# EAGLE design SBC6809R3 (EAGLE 4.16)
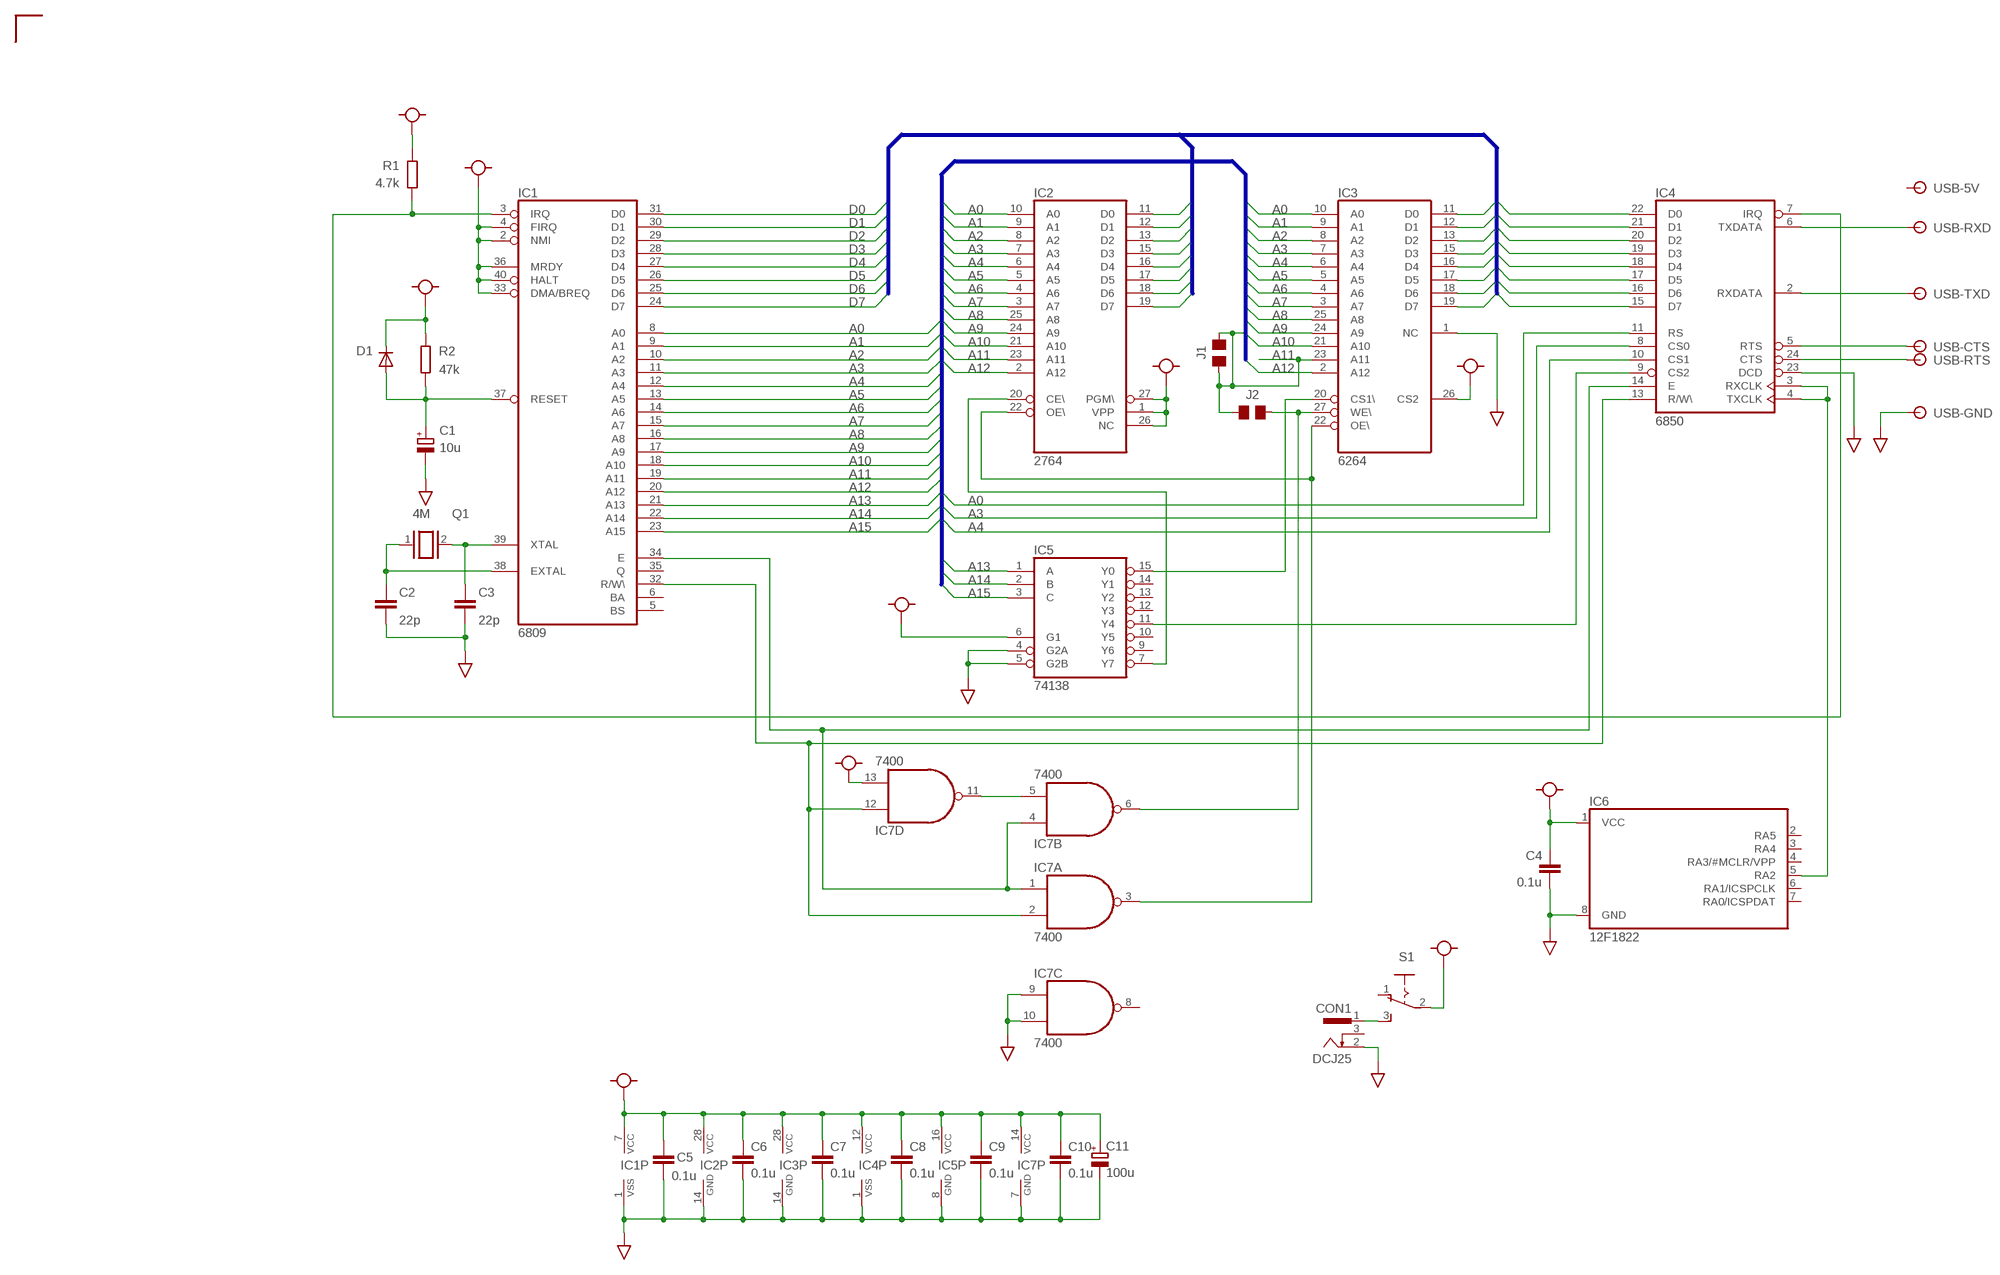
[diagram p0: schematic, sheet 1]

## Parts
C1  10u  C-TANTALUM  [C4518]
C2  22p  C-CERAMIC  [C025-025X050]
C3  22p  C-CERAMIC  [C025-025X050]
C4  0.1u  C-CERAMIC  [C025-025X050]
C5  0.1u  C-CERAMIC  [C025-025X050]
C6  0.1u  C-CERAMIC  [C025-025X050]
C7  0.1u  C-CERAMIC  [C025-025X050]
C8  0.1u  C-CERAMIC  [C025-025X050]
C9  0.1u  C-CERAMIC  [C025-025X050]
C10  0.1u  C-CERAMIC  [C025-025X050]
C11  100u  C-TANTALUM  [C4518]
CON1  DCJ25  [SCD-014-A]
D1  1S1588  [DO41-10]
IC1  6809  [DIL40]
IC2  2764  [DIL28]
IC3  6264  6264ASP  [DIL28-3]
IC4  6850  [DIL24]
IC5  74138  [DIL16]
IC6  12F1822  PIC12F1822  [DIL08]
IC7  7400  [DIL14]
J1  SOLPAD  [SOLPAD]
J2  SOLPAD  [SOLPAD]
Q1  4M  XTAL/S  [QS]
R1  4.7k  R1/8W  [0207/10]
R2  47k  R1/8W  [0207/10]
S1  255SB  [255SB]
USB-  USB-SERIAL6P  [TTL-232R-5V]

## Nets
A0: IC1.8(A0) IC2.10(A0) IC3.10(A0) IC4.11(RS)
A1: IC1.9(A1) IC2.9(A1) IC3.9(A1)
A2: IC1.10(A2) IC2.8(A2) IC3.8(A2)
A3: IC1.11(A3) IC2.7(A3) IC3.7(A3) IC4.8(CS0)
A4: IC1.12(A4) IC2.6(A4) IC3.6(A4) IC4.10(CS1)
A5: IC1.13(A5) IC2.5(A5) IC3.5(A5)
A6: IC1.14(A6) IC2.4(A6) IC3.4(A6)
A7: IC1.15(A7) IC2.3(A7) IC3.3(A7)
A8: IC1.16(A8) IC2.25(A8) IC3.25(A8)
A9: IC1.17(A9) IC2.24(A9) IC3.24(A9)
A10: IC1.18(A10) IC2.21(A10) IC3.21(A10)
A11: IC1.19(A11) IC2.23(A11) IC3.23(A11) J1.1 J1.2 J2.1
A12: IC1.20(A12) IC2.2(A12) IC3.2(A12)
A13: IC1.21(A13) IC5.1(A)
A14: IC1.22(A14) IC5.2(B)
A15: IC1.23(A15) IC5.3(C)
D0: IC1.31(D0) IC2.11(D0) IC3.11(D0) IC4.22(D0)
D1: IC1.30(D1) IC2.12(D1) IC3.12(D1) IC4.21(D1)
D2: IC1.29(D2) IC2.13(D2) IC3.13(D2) IC4.20(D2)
D3: IC1.28(D3) IC2.15(D3) IC3.15(D3) IC4.19(D3)
D4: IC1.27(D4) IC2.16(D4) IC3.16(D4) IC4.18(D4)
D5: IC1.26(D5) IC2.17(D5) IC3.17(D5) IC4.17(D5)
D6: IC1.25(D6) IC2.18(D6) IC3.18(D6) IC4.16(D6)
D7: IC1.24(D7) IC2.19(D7) IC3.19(D7) IC4.15(D7)
GND: C1.- C2.2 C3.2 C4.2 C5.2 C6.2 C7.2 C8.2 C9.2 C10.2 C11.- CON1.2 IC1.1(GND) IC2.14(GND) IC3.1(NC) IC3.14(GND) IC4.1(GND) IC4.23(DCD) IC5.4(G2A) IC5.5(G2B) IC5.8(GND) IC6.8(GND) IC7.7(P:GND) IC7.9(C:I0) IC7.10(C:I1) USB-.1
N$1: IC3.20(CS1\) IC5.15(Y0)
N$2: IC2.20(CE\) IC5.7(Y7)
N$3: IC1.3(IRQ) IC4.7(IRQ) R1.1
N$5: IC2.22(OE\) IC3.22(OE\) IC7.3(A:O)
N$6: IC7.5(B:I1) IC7.11(D:O)
N$7: IC1.32(R/W\) IC4.13(R/W\) IC7.2(A:I1) IC7.12(D:I0)
N$8: C2.1 IC1.38(EXTAL) Q1.1
N$9: CON1.1 S1.3(S)
N$10: IC4.3(RXCLK) IC4.4(TXCLK) IC6.5(RA2)
N$11: IC4.6(TXDATA) USB-.5
N$12: IC4.2(RXDATA) USB-.4
N$13: IC4.5(RTS) USB-.2
N$14: IC4.24(CTS) USB-.6
N$15: IC4.9(CS2) IC5.11(Y4)
N$16: IC3.27(WE\) IC7.6(B:O) J2.2
N$17: C3.1 IC1.39(XTAL) Q1.2
N$18: C1.+ D1.A IC1.37(RESET) R2.1
N$25: IC1.34(E) IC4.14(E) IC7.1(A:I0) IC7.4(B:I0)
VCC: C4.1 C5.1 C6.1 C7.1 C8.1 C9.1 C10.1 C11.+ D1.C IC1.2(NMI) IC1.4(FIRQ) IC1.7(VCC) IC1.33(DMA/BREQ) IC1.36(MRDY) IC1.40(HALT) IC2.1(VPP) IC2.26(NC) IC2.27(PGM\) IC2.28(VCC) IC3.26(CS2) IC3.28(VCC) IC4.12(VCC) IC5.6(G1) IC5.16(VCC) IC6.1(VCC) IC7.13(D:I1) IC7.14(P:VCC) R1.2 R2.2 S1.2(P)
Unconnected: CON1.3 IC1.5(BS) IC1.6(BA) IC1.35(Q) IC5.9(Y6) IC5.10(Y5) IC5.12(Y3) IC5.13(Y2) IC5.14(Y1) IC6.2(RA5) IC6.3(RA4) IC6.4(RA3/#MCLR/VPP) IC6.6(RA1/ICSPCLK) IC6.7(RA0/ICSPDAT) IC7.8(C:O) S1.1(O) USB-.3

## Buses
A[0..15]
D[0..7]

## Library data of the parts
C1 C11 = olimex-devices:C-TANTALUM: Tantalum Condenser
C2-C10 = olimex-devices:C-CERAMIC: Ceramic Conenser
CON1 = olimex-devices:DCJ25: Standerd AC Adupter Jack
D1 = olimex-devices:1S1588: Small Signal Diode
IC1 = olimex-devices:6809: MOTOROLA CPU
IC2 = olimex-devices:2764: MEMORY UVEPROM 8Kbit x 8
IC3 = olimex-devices:6264ASP
IC4 = olimex-devices:6850: MOTOROLA ACIA
IC5 = olimex-devices:74138: 3-line to 8-line DECODER/DEMULTIPLEXER
IC6 = olimex-devices:PIC12F1822
IC7 = olimex-devices:7400: Quad 2-input NAND gate
J1 J2 = olimex-devices:SOLPAD
Q1 = olimex-devices:XTAL/S: X'tal Oscirator
R1 R2 = olimex-devices:R1/8W: Carbon Resistor
S1 = olimex-devices:255SB: SLIDING SWITCH distributor Buerklin, 11G810
USB- = olimex-devices:USB-SERIAL6P

## Net classes
2 Vcc: width 0.508 mm

## Board
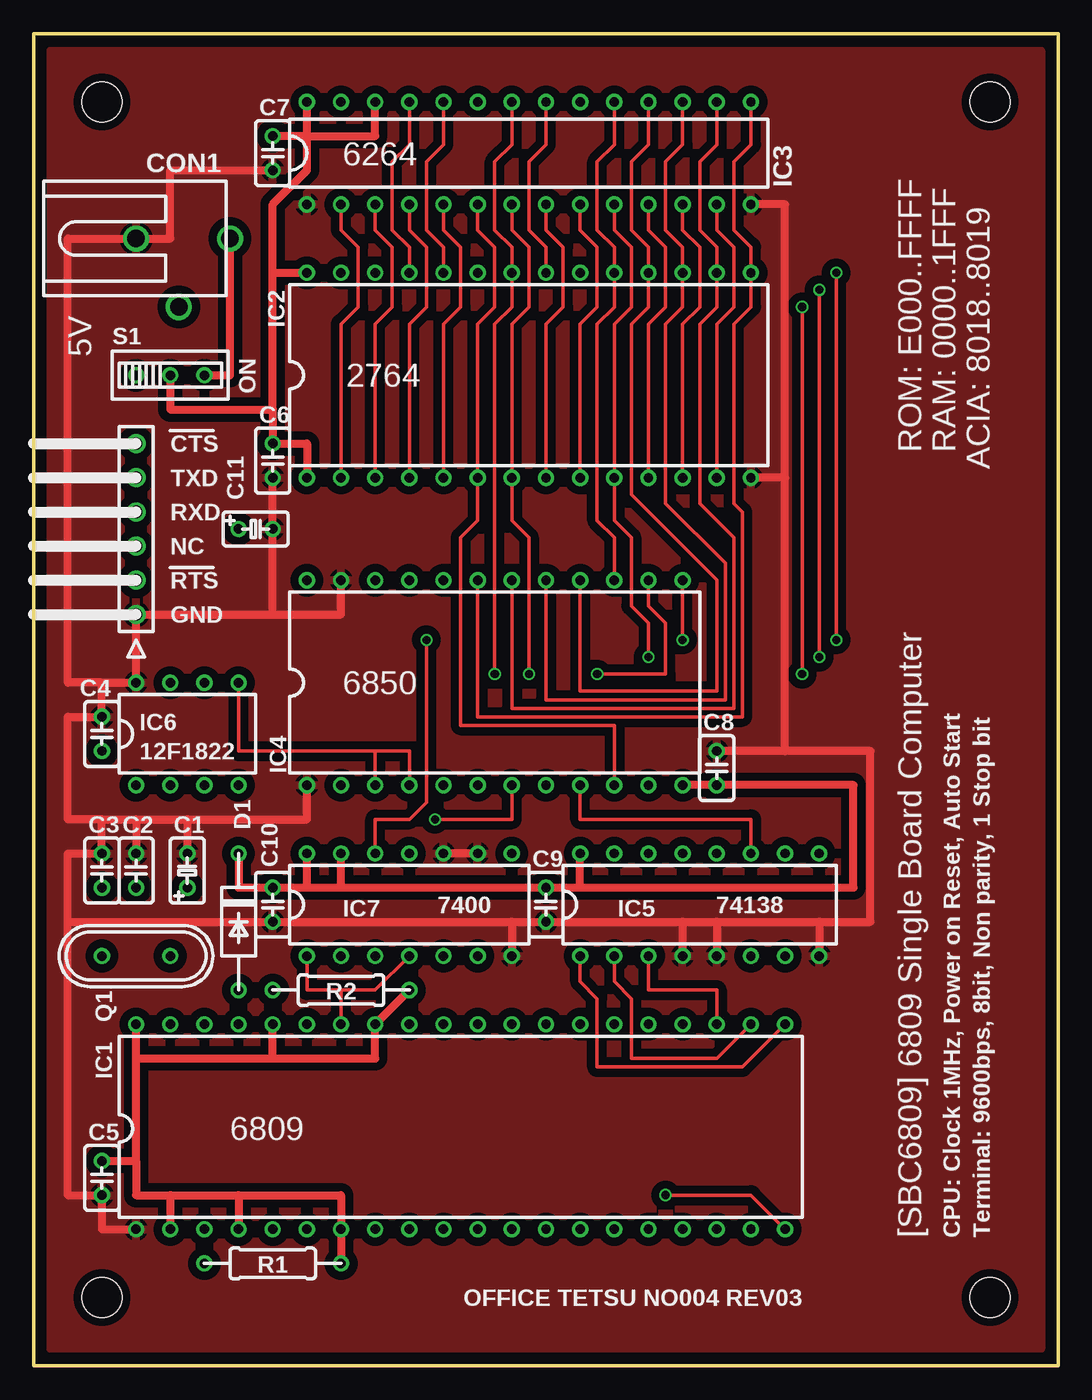
[diagram p1: board, top side]
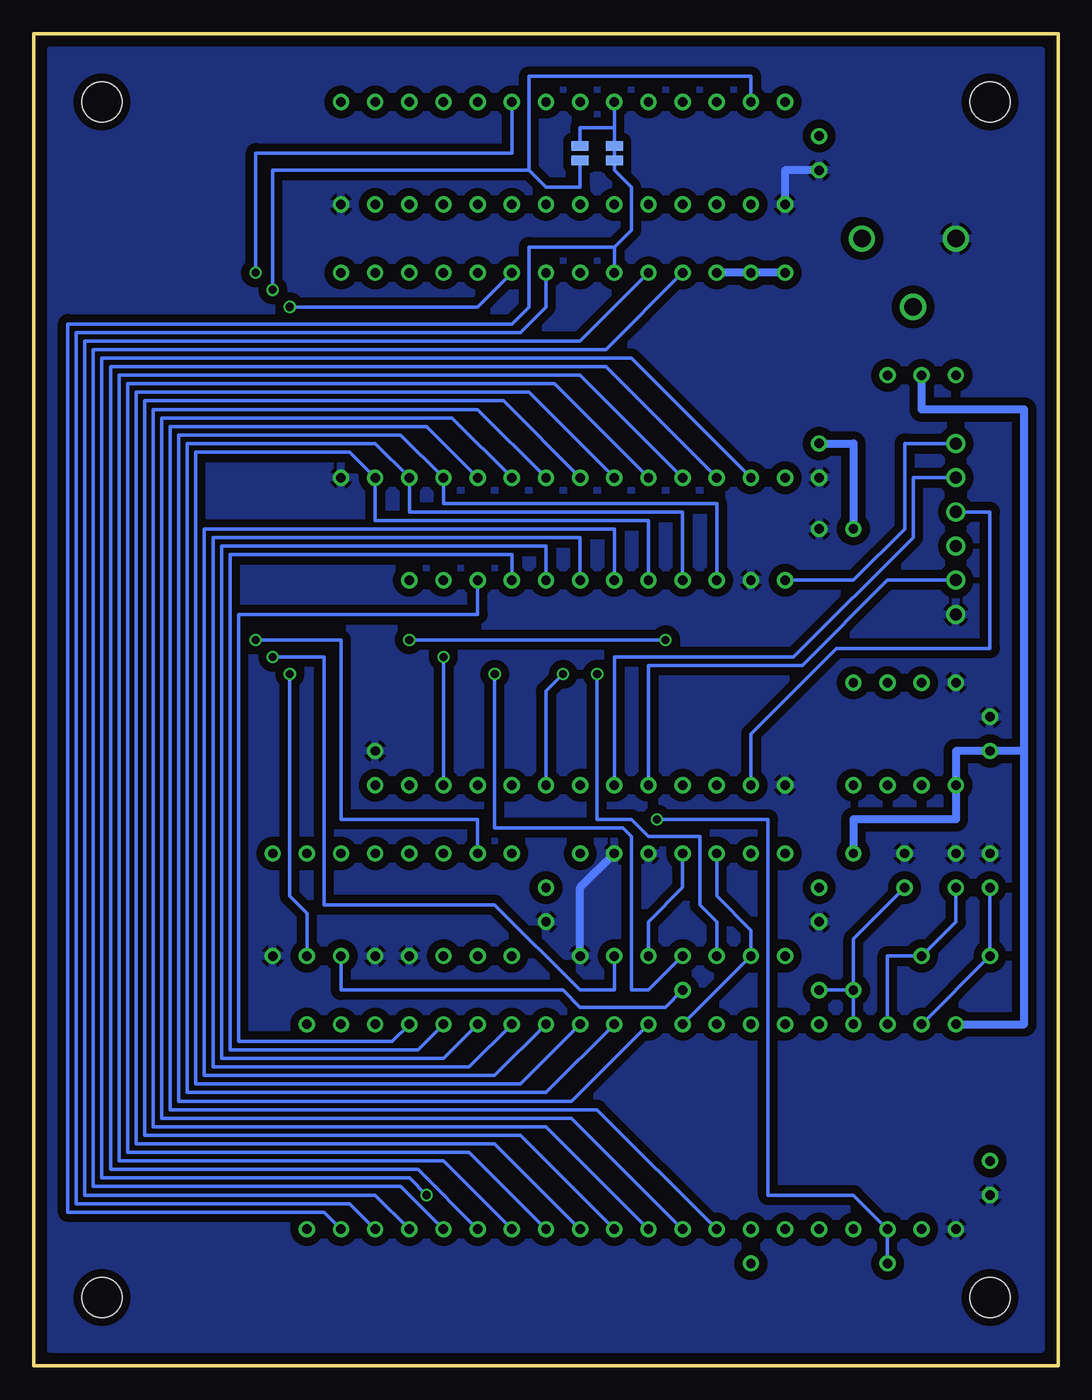
[diagram p2: board, bottom side, seen from below]

Size 76.2 x 99.06 mm. Coordinates in mm from the lower left corner, seen from the top.
Outline: 76.2,0 76.2,99.06 0,99.06 0,0 76.2,0
Copper layers (1*16): Top 0.035mm / dielectric 1.5mm / Bottom 0.035mm
Design rules "SeeedStudio": minimum track width 6mil, minimum drill 12mil, track to track 6mil, track to pad 6mil, pad to pad 6mil, via to via 6mil, smd to smd 0mil, copper to edge 10mil, drill to drill 10mil, minimum pad ring 10mil, minimum via ring 6mil, stop-mask expansion 2mil, vias tented up to drill 25mil, thermal gap 10mil
Holes 3 mm at 5.08,5.08 71.12,5.08 71.12,93.98 5.08,93.98

### Footprints (pad centres in the part's own frame; a part is rotated, then mirrored left to right if it is on the bottom)
C4518 = drill 0.7 round: + -1.27,0; - 1.27,0
C025-025X050 = drill 0.7 round: 1 -1.27,0; 2 1.27,0
SCD-014-A = drill 1.3 round: 1 0,11.43; 2 0,4.445; 3 5.08,7.62
DO41-10 = drill 0.7 round: A 5.08,0; C -5.08,0
DIL40 = drill 0.7 round: 1 -24.13,-7.62; 2 -21.59,-7.62; 3 -19.05,-7.62; 4 -16.51,-7.62; 5 -13.97,-7.62; 6 -11.43,-7.62; 7 -8.89,-7.62; 8 -6.35,-7.62; 9 -3.81,-7.62; 10 -1.27,-7.62; 11 1.27,-7.62; 12 3.81,-7.62; 13 6.35,-7.62; 14 8.89,-7.62; 15 11.43,-7.62; 16 13.97,-7.62; 17 16.51,-7.62; 18 19.05,-7.62; 19 21.59,-7.62; 20 24.13,-7.62; 21 24.13,7.62; 22 21.59,7.62; 23 19.05,7.62; 24 16.51,7.62; 25 13.97,7.62; 26 11.43,7.62; 27 8.89,7.62; 28 6.35,7.62; 29 3.81,7.62; 30 1.27,7.62; 31 -1.27,7.62; 32 -3.81,7.62; 33 -6.35,7.62; 34 -8.89,7.62; 35 -11.43,7.62; 36 -13.97,7.62; 37 -16.51,7.62; 38 -19.05,7.62; 39 -21.59,7.62; 40 -24.13,7.62
DIL28 = drill 0.7 round: 1 -16.51,-7.62; 2 -13.97,-7.62; 3 -11.43,-7.62; 4 -8.89,-7.62; 5 -6.35,-7.62; 6 -3.81,-7.62; 7 -1.27,-7.62; 8 1.27,-7.62; 9 3.81,-7.62; 10 6.35,-7.62; 11 8.89,-7.62; 12 11.43,-7.62; 13 13.97,-7.62; 14 16.51,-7.62; 15 16.51,7.62; 16 13.97,7.62; 17 11.43,7.62; 18 8.89,7.62; 19 6.35,7.62; 20 3.81,7.62; 21 1.27,7.62; 22 -1.27,7.62; 23 -3.81,7.62; 24 -6.35,7.62; 25 -8.89,7.62; 26 -11.43,7.62; 27 -13.97,7.62; 28 -16.51,7.62
DIL28-3 = drill 0.7 round: 1 -16.51,-3.81; 2 -13.97,-3.81; 3 -11.43,-3.81; 4 -8.89,-3.81; 5 -6.35,-3.81; 6 -3.81,-3.81; 7 -1.27,-3.81; 8 1.27,-3.81; 9 3.81,-3.81; 10 6.35,-3.81; 11 8.89,-3.81; 12 11.43,-3.81; 13 13.97,-3.81; 14 16.51,-3.81; 15 16.51,3.81; 16 13.97,3.81; 17 11.43,3.81; 18 8.89,3.81; 19 6.35,3.81; 20 3.81,3.81; 21 1.27,3.81; 22 -1.27,3.81; 23 -3.81,3.81; 24 -6.35,3.81; 25 -8.89,3.81; 26 -11.43,3.81; 27 -13.97,3.81; 28 -16.51,3.81
DIL24 = drill 0.7 round: 1 -13.97,-7.62; 2 -11.43,-7.62; 3 -8.89,-7.62; 4 -6.35,-7.62; 5 -3.81,-7.62; 6 -1.27,-7.62; 7 1.27,-7.62; 8 3.81,-7.62; 9 6.35,-7.62; 10 8.89,-7.62; 11 11.43,-7.62; 12 13.97,-7.62; 13 13.97,7.62; 14 11.43,7.62; 15 8.89,7.62; 16 6.35,7.62; 17 3.81,7.62; 18 1.27,7.62; 19 -1.27,7.62; 20 -3.81,7.62; 21 -6.35,7.62; 22 -8.89,7.62; 23 -11.43,7.62; 24 -13.97,7.62
DIL16 = drill 0.7 round: 1 -8.89,-3.81; 2 -6.35,-3.81; 3 -3.81,-3.81; 4 -1.27,-3.81; 5 1.27,-3.81; 6 3.81,-3.81; 7 6.35,-3.81; 8 8.89,-3.81; 9 8.89,3.81; 10 6.35,3.81; 11 3.81,3.81; 12 1.27,3.81; 13 -1.27,3.81; 14 -3.81,3.81; 15 -6.35,3.81; 16 -8.89,3.81
DIL08 = drill 0.7 round: 1 -3.81,-3.81; 2 -1.27,-3.81; 3 1.27,-3.81; 4 3.81,-3.81; 5 3.81,3.81; 6 1.27,3.81; 7 -1.27,3.81; 8 -3.81,3.81
DIL14 = drill 0.7 round: 1 -7.62,-3.81; 2 -5.08,-3.81; 3 -2.54,-3.81; 4 0,-3.81; 5 2.54,-3.81; 6 5.08,-3.81; 7 7.62,-3.81; 8 7.62,3.81; 9 5.08,3.81; 10 2.54,3.81; 11 0,3.81; 12 -2.54,3.81; 13 -5.08,3.81; 14 -7.62,3.81
SOLPAD = smd 0.736 x 1.27: 1 -0.54,0; 2 0.54,0
QS = drill 0.7 round: 1 -2.54,0; 2 2.54,0
0207/10 = drill 0.7 round: 1 -5.08,0; 2 5.08,0
255SB = drill 0.7 round: 1 -2.54,0; 2 0,0; 3 2.54,0
TTL-232R-5V = drill 0.9 round: 1 -6.35,0; 2 -3.81,0; 3 -1.27,0; 4 1.27,0; 5 3.81,0; 6 6.35,0

### Placement (x,y rotation side)
C1  11.43,36.83 90 top
C2  7.62,36.83 90 top
C3  5.08,36.83 90 top
C4  5.08,46.99 90 top
C5  5.08,13.97 270 top
C6  17.78,67.31 270 top
C7  17.78,90.17 270 top
C8  50.8,44.45 90 top
C9  38.1,34.29 270 top
C10  17.78,34.29 270 top
C11  16.51,62.23 0 top
CON1  3.17,83.82 270 top
D1  15.24,33.02 270 top
IC1  31.75,17.78 0 top
IC2  36.83,73.66 0 top
IC3  36.83,90.17 0 top
IC4  34.29,50.8 0 top
IC5  49.53,34.29 0 top
IC6  11.43,46.99 0 top
IC7  27.94,34.29 0 top
J1  33.02,90.17 270 bottom
J2  35.56,90.17 270 bottom
Q1  7.62,30.48 180 top
R1  17.78,7.62 0 top
R2  22.86,27.94 0 top
S1  10.16,73.66 0 top
USB-  7.62,62.23 90 top

### Tracks (layer width: path | path; a pad name or v marks a point on that pad's centre or on a via)
A0  (via drill 0.6)
  Top 0.254: IC3.10 43.18,84.45 44.45,83.19 44.45,78.74 43.18,77.47 IC2.10 43.18,62.87 44.45,61.59 44.45,56.52 45.72,55.24 v45.72,52.7
  Bottom 0.254: v45.72,52.7 IC4.11 | IC1.8 34.29,19.05 66.04,19.05 66.04,69.85 46.99,69.85 IC2.10
A1
  Top 0.254: IC2.9 40.64,77.47 41.91,78.74 41.91,83.19 40.64,84.45 IC3.9
  Bottom 0.254: IC2.9 45.09,70.48 66.67,70.48 66.67,18.41 36.2,18.41 IC1.9
A2
  Top 0.254: IC2.8 38.1,77.47 39.37,78.74 39.37,83.19 38.1,84.45 IC3.8
  Bottom 0.254: IC2.8 43.18,71.12 67.31,71.12 67.31,17.78 38.1,17.78 IC1.10
A3  (via drill 0.6)
  Top 0.254: IC3.7 35.56,84.45 36.83,83.19 36.83,78.74 35.56,77.47 IC2.7 35.56,62.87 36.83,61.59 v36.83,51.44
  Bottom 0.254: IC2.7 41.27,71.75 67.94,71.75 67.94,17.14 40.01,17.14 IC1.11 | IC4.8 38.1,50.16 v36.83,51.44
A4
  Top 0.254: IC3.6 33.02,84.45 34.29,83.19 34.29,78.74 33.02,77.47 IC2.6 33.02,62.87 31.75,61.59 31.75,47.62 43.18,47.62 IC4.10
  Bottom 0.254: IC2.6 39.37,72.39 68.58,72.39 68.58,16.51 41.91,16.51 IC1.12
A5
  Top 0.254: IC2.5 30.48,77.47 31.75,78.74 31.75,83.19 30.48,84.45 IC3.5
  Bottom 0.254: IC2.5 37.47,73.03 69.22,73.03 69.22,15.88 43.81,15.88 IC1.13
A6
  Top 0.254: IC3.4 27.94,84.45 29.21,83.19 29.21,78.74 27.94,77.47 IC2.4
  Bottom 0.254: IC2.4 35.56,73.66 69.85,73.66 69.85,15.24 45.72,15.24 IC1.14
A7
  Top 0.254: IC3.3 25.4,84.45 26.67,83.19 26.67,78.74 25.4,77.47 IC2.3
  Bottom 0.254: IC2.3 33.66,74.3 70.48,74.3 70.48,14.61 47.62,14.61 IC1.15
A8
  Top 0.254: IC3.25 27.94,90.81 26.67,89.53 26.67,84.45 27.94,83.19 IC2.25
  Bottom 0.254: IC2.25 33.66,75.56 71.75,75.56 71.75,13.34 48.9,13.34 IC1.16
A9
  Top 0.254: IC3.24 30.48,90.81 29.21,89.53 29.21,84.45 30.48,83.19 IC2.24
  Bottom 0.254: IC2.24 35.56,76.2 72.39,76.2 72.39,12.7 50.8,12.7 IC1.17
A10
  Top 0.254: IC3.21 38.1,90.81 36.83,89.53 36.83,84.45 38.1,83.19 IC2.21
  Bottom 0.254: IC2.21 38.1,78.74 40.01,76.83 73.03,76.83 73.03,12.06 52.7,12.06 IC1.18
A11
  Bottom 0.254: 33.02,83.19 31.75,84.45 31.75,87.63 33.02,88.9 J1.2 33.02,90.81 | 33.02,83.19 IC2.23 | 33.02,83.19 39.37,83.19 39.37,78.74 40.64,77.47 73.66,77.47 73.66,11.43 54.61,11.43 IC1.19 | 33.02,92.08 IC3.23 | J2.1 35.56,92.08 33.02,92.08 | 33.02,90.81 33.02,92.08 | 33.02,90.81 J1.1
A12  (via drill 0.6)
  Top 0.254: IC2.2 22.86,77.47 24.13,78.74 24.13,83.19 22.86,84.45 IC3.2 | IC1.20 53.34,12.7 v46.99,12.7
  Bottom 0.254: v46.99,12.7 48.26,13.97 71.12,13.97 71.12,74.93 31.75,74.93 IC2.2
A13
  Top 0.254: IC5.1 40.64,28.57 41.91,27.3 41.91,22.23 52.7,22.23 IC1.21
A14
  Top 0.254: IC5.2 43.18,28.57 44.45,27.3 44.45,22.86 50.8,22.86 IC1.22
A15
  Top 0.254: IC5.3 45.72,27.94 50.8,27.94 IC1.23
D0
  Top 0.254: IC2.11 45.72,77.47 46.99,78.74 46.99,83.19 45.72,84.45 IC3.11
  Bottom 0.254: IC4.22 25.4,64.14 45.72,64.14 IC2.11 48.9,69.22 65.41,69.22 65.41,19.68 36.2,19.68 IC1.31
D1
  Top 0.254: IC2.12 48.26,77.47 49.53,78.74 49.53,83.19 48.26,84.45 IC3.12
  Bottom 0.254: IC4.21 27.94,63.5 48.26,63.5 IC2.12 50.8,68.58 64.77,68.58 64.77,20.32 38.1,20.32 IC1.30
D2
  Top 0.254: IC2.13 50.8,77.47 52.07,78.74 52.07,83.19 50.8,84.45 IC3.13
  Bottom 0.254: IC4.20 30.48,62.87 50.8,62.87 IC2.13 52.7,67.94 64.14,67.94 64.14,20.95 40.01,20.95 IC1.29
D3
  Top 0.254: IC3.15 53.34,90.81 52.07,89.53 52.07,84.45 53.34,83.19 IC2.15 53.34,78.74 52.07,77.47 52.07,64.14 52.7,63.5 52.7,48.26 33.02,48.26 IC4.19
  Bottom 0.254: IC4.19 33.02,62.23 63.5,62.23 63.5,21.59 41.91,21.59 IC1.28
D4
  Top 0.254: IC3.16 50.8,90.81 49.53,89.53 49.53,84.45 50.8,83.19 IC2.16 50.8,78.74 49.53,77.47 49.53,64.14 52.07,61.59 52.07,48.9 35.56,48.9 IC4.18
  Bottom 0.254: IC4.18 35.56,61.59 62.87,61.59 62.87,22.23 43.81,22.23 IC1.27
D5
  Top 0.254: IC3.17 48.26,90.81 46.99,89.53 46.99,84.45 48.26,83.19 IC2.17 48.26,78.74 46.99,77.47 46.99,64.14 51.44,59.69 51.44,49.53 38.1,49.53 IC4.17
  Bottom 0.254: IC4.17 38.1,60.96 62.23,60.96 62.23,22.86 45.72,22.86 IC1.26
D6
  Top 0.254: IC3.18 45.72,90.81 44.45,89.53 44.45,84.45 45.72,83.19 IC2.18 45.72,78.74 44.45,77.47 44.45,64.77 50.8,58.42 50.8,50.16 40.64,50.16 IC4.16
  Bottom 0.254: IC4.16 40.64,60.33 61.59,60.33 61.59,23.5 47.62,23.5 IC1.25
D7
  Top 0.254: IC3.19 43.18,90.81 41.91,89.53 41.91,84.45 43.18,83.19 IC2.19 43.18,78.74 41.91,77.47 41.91,62.87 43.18,61.59 IC4.15
  Bottom 0.254: IC4.15 43.18,55.88 60.96,55.88 60.96,24.13 49.53,24.13 IC1.24
GND
  Top 0.61: 50.8,33.02 58.42,33.02 | 48.26,33.02 50.8,33.02 | 48.26,33.02 IC5.4 | 50.8,33.02 IC5.5 | 55.88,66.04 55.88,86.36 IC3.14 | 55.88,45.72 55.88,66.04 | 5.08,50.8 C4.2 2.54,48.26 2.54,40.64 5.08,40.64 | 5.08,50.8 IC6.8 USB-.1 17.78,55.88 | 55.88,45.72 62.23,45.72 62.23,33.02 58.42,33.02 | 5.08,40.64 7.62,40.64 | 7.62,40.64 11.43,40.64 | 11.43,40.64 20.32,40.64 IC4.1 | 5.08,50.8 2.54,50.8 2.54,83.82 CON1.2 10.16,83.82 10.16,88.9 C7.2 | 35.56,33.02 C9.2 48.26,33.02 | 35.56,33.02 C10.2 2.54,33.02 | 35.56,33.02 IC7.7 | C6.2 C11.- 17.78,55.88 | IC4.23 22.86,55.88 17.78,55.88 | 55.88,66.04 IC2.14 | IC7.9 IC7.10 | 55.88,45.72 C8.2 | 58.42,33.02 IC5.8 | 11.43,40.64 C1.- | 7.62,40.64 C2.2 | 5.08,40.64 C3.2 2.54,38.1 2.54,33.02 | IC1.1 5.08,10.16 C5.2 2.54,12.7 2.54,33.02
  Bottom 0.61: IC7.9 35.56,35.56 IC7.7 | C7.2 20.32,88.9 IC3.1
  pour Bottom (isolate 0.61): 1.27,97.79 74.93,97.79 74.93,1.27 1.27,1.27
  pour Top (isolate 0.61): 1.27,97.79 74.93,97.79 74.93,1.27 1.27,1.27
N$1  (via drill 0.6)
  Top 0.254: v59.69,53.98 v59.69,81.28
  Bottom 0.254: IC5.15 43.18,40.64 53.34,40.64 53.34,53.98 v59.69,53.98 | v59.69,81.28 59.69,90.17 40.64,90.17 IC3.20
N$2  (via drill 0.6)
  Top 0.254: v57.15,51.44 v57.15,78.74
  Bottom 0.254: IC5.7 55.88,33.66 57.15,34.92 v57.15,51.44 | v57.15,78.74 43.18,78.74 IC2.20
N$3  (via drill 0.6)
  Top 0.254: v29.84,40.64 35.56,40.64 IC4.7
  Bottom 0.254: v29.84,40.64 21.59,40.64 21.59,12.7 15.24,12.7 IC1.3 R1.1
N$5  (via drill 0.6)
  Top 0.254: IC3.22 35.56,90.81 34.29,89.53 34.29,84.45 35.56,83.19 IC2.22 35.56,78.74 34.29,77.47 v34.29,51.44
  Bottom 0.254: v34.29,51.44 34.29,40.64 31.75,40.64 30.48,39.37 26.67,39.37 26.67,34.29 25.4,33.02 IC7.3
N$6
  Bottom 0.254: IC7.5 30.48,33.02 27.94,35.56 IC7.11
N$7  (via drill 0.6)
  Top 0.254: IC7.12 25.4,40.64 27.94,40.64 29.21,41.91 v29.21,53.98 | v48.26,53.98 IC4.13
  Bottom 0.254: IC7.12 25.4,34.92 22.86,32.38 IC7.2 IC1.32 | v29.21,53.98 v48.26,53.98
N$8
  Bottom 0.254: C2.1 7.62,33.02 Q1.1 12.7,30.48 IC1.38
N$9
  Top 0.61: CON1.1 14.61,73.66 S1.3
N$10
  Top 0.254: 25.4,45.72 IC4.3 | IC6.5 15.24,45.72 25.4,45.72 | IC4.4 27.94,45.72 25.4,45.72
N$11
  Bottom 0.254: IC4.6 33.02,52.7 19.68,52.7 10.79,61.59 10.79,66.04 USB-.5
N$12
  Bottom 0.254: USB-.4 5.08,63.5 5.08,53.34 16.51,53.34 22.86,46.99 IC4.2
N$13
  Bottom 0.254: IC4.5 30.48,52.07 19.05,52.07 12.7,58.42 USB-.2
N$14
  Bottom 0.254: USB-.6 11.43,68.58 11.43,62.23 15.24,58.42 IC4.24
N$15
  Top 0.254: IC5.11 53.34,40.64 40.64,40.64 IC4.9
N$16  (via drill 0.6)
  Top 0.254: v58.42,52.7 v58.42,80.01
  Bottom 0.254: IC7.6 33.02,27.94 35.56,27.94 41.91,34.29 54.61,34.29 54.61,52.7 v58.42,52.7 | v58.42,80.01 58.42,88.9 39.37,88.9 | 39.37,88.9 39.37,95.89 22.86,95.89 IC3.27 | 39.37,88.9 38.1,87.63 35.56,87.63 J2.2
N$17
  Bottom 0.254: C3.1 Q1.2 IC1.39
N$18
  Bottom 0.254: IC1.37 D1.A | D1.A R2.1 | C1.+ 15.24,31.75 D1.A
N$25  (via drill 0.6)
  Top 0.254: 22.86,27.94 20.32,27.94 IC7.1 | 22.86,27.94 25.4,27.94 IC7.4 | v41.91,51.44 46.99,51.44 46.99,55.24 45.72,56.52 IC4.14 | IC1.34 22.86,27.94
  Bottom 0.254: IC7.4 30.48,27.94 31.75,27.94 31.75,39.37 32.38,40.01 41.91,40.01 v41.91,51.44
VCC
  Top 0.61: 20.32,91.44 25.4,91.44 IC3.26 | IC2.1 20.32,68.58 C6.1 17.78,71.12 | S1.2 10.16,71.12 17.78,71.12 | 17.78,81.28 17.78,86.36 20.32,88.9 20.32,91.44 | IC4.12 C8.1 60.96,43.18 60.96,35.56 40.64,35.56 | 40.64,35.56 C9.1 22.86,35.56 | 40.64,35.56 IC5.16 | 20.32,91.44 IC3.28 | 20.32,91.44 C7.1 | 17.78,81.28 IC2.28 | 17.78,71.12 17.78,81.28 | 20.32,35.56 C10.1 15.24,35.56 D1.C | 20.32,35.56 22.86,35.56 | 22.86,35.56 IC7.13 | 20.32,35.56 IC7.14 | R2.2 IC1.33 25.4,22.86 17.78,22.86 | 17.78,22.86 IC1.36 | R1.2 IC1.7 22.86,12.7 15.24,12.7 | 15.24,12.7 IC1.4 | 7.62,22.86 IC1.40 | 7.62,22.86 17.78,22.86 | 7.62,15.24 7.62,22.86 | C5.1 7.62,15.24 | 10.16,12.7 IC1.2 | 10.16,12.7 7.62,12.7 7.62,15.24 | 10.16,12.7 15.24,12.7
  Bottom 0.254: IC5.6 53.34,27.94 36.83,27.94 35.56,26.67 29.21,26.67 R2.2
  Bottom 0.61: 2.54,45.72 2.54,25.4 IC1.40 | 2.54,45.72 C4.1 7.62,45.72 IC6.1 7.62,40.64 15.24,40.64 D1.C | 2.54,45.72 2.54,71.12 10.16,71.12 S1.2 | IC2.26 IC2.27 IC2.28 | C11.+ 15.24,68.58 C6.1

### Text on the board
tPlace: 5V | ON | CTS | ROM: E000..FFFF | RAM: 0000..1FFF | ACIA: 8018..8019 | TXD | RXD | NC | RTS | GND | [SBC6809] 6809 Single Board Computer | CPU: Clock 1MHz, Power on Reset, Auto Start | Terminal: 9600bps, 8bit, Non parity, 1 Stop bit | OFFICE TETSU NO004 REV03